# Altium schematic sheet Контроллер.SchDoc
size 594 x 420 mm; Address1: Address1; Address2: Address2; Address3: Address3; Address4: Address4; DocumentNumber: АБВГ.123456.001 Э3; SheetNumber: 1; Scale: 1:1; DocumentType: Схема электрическая принципиальная; FirstReferrence: АБВГ.123456.001
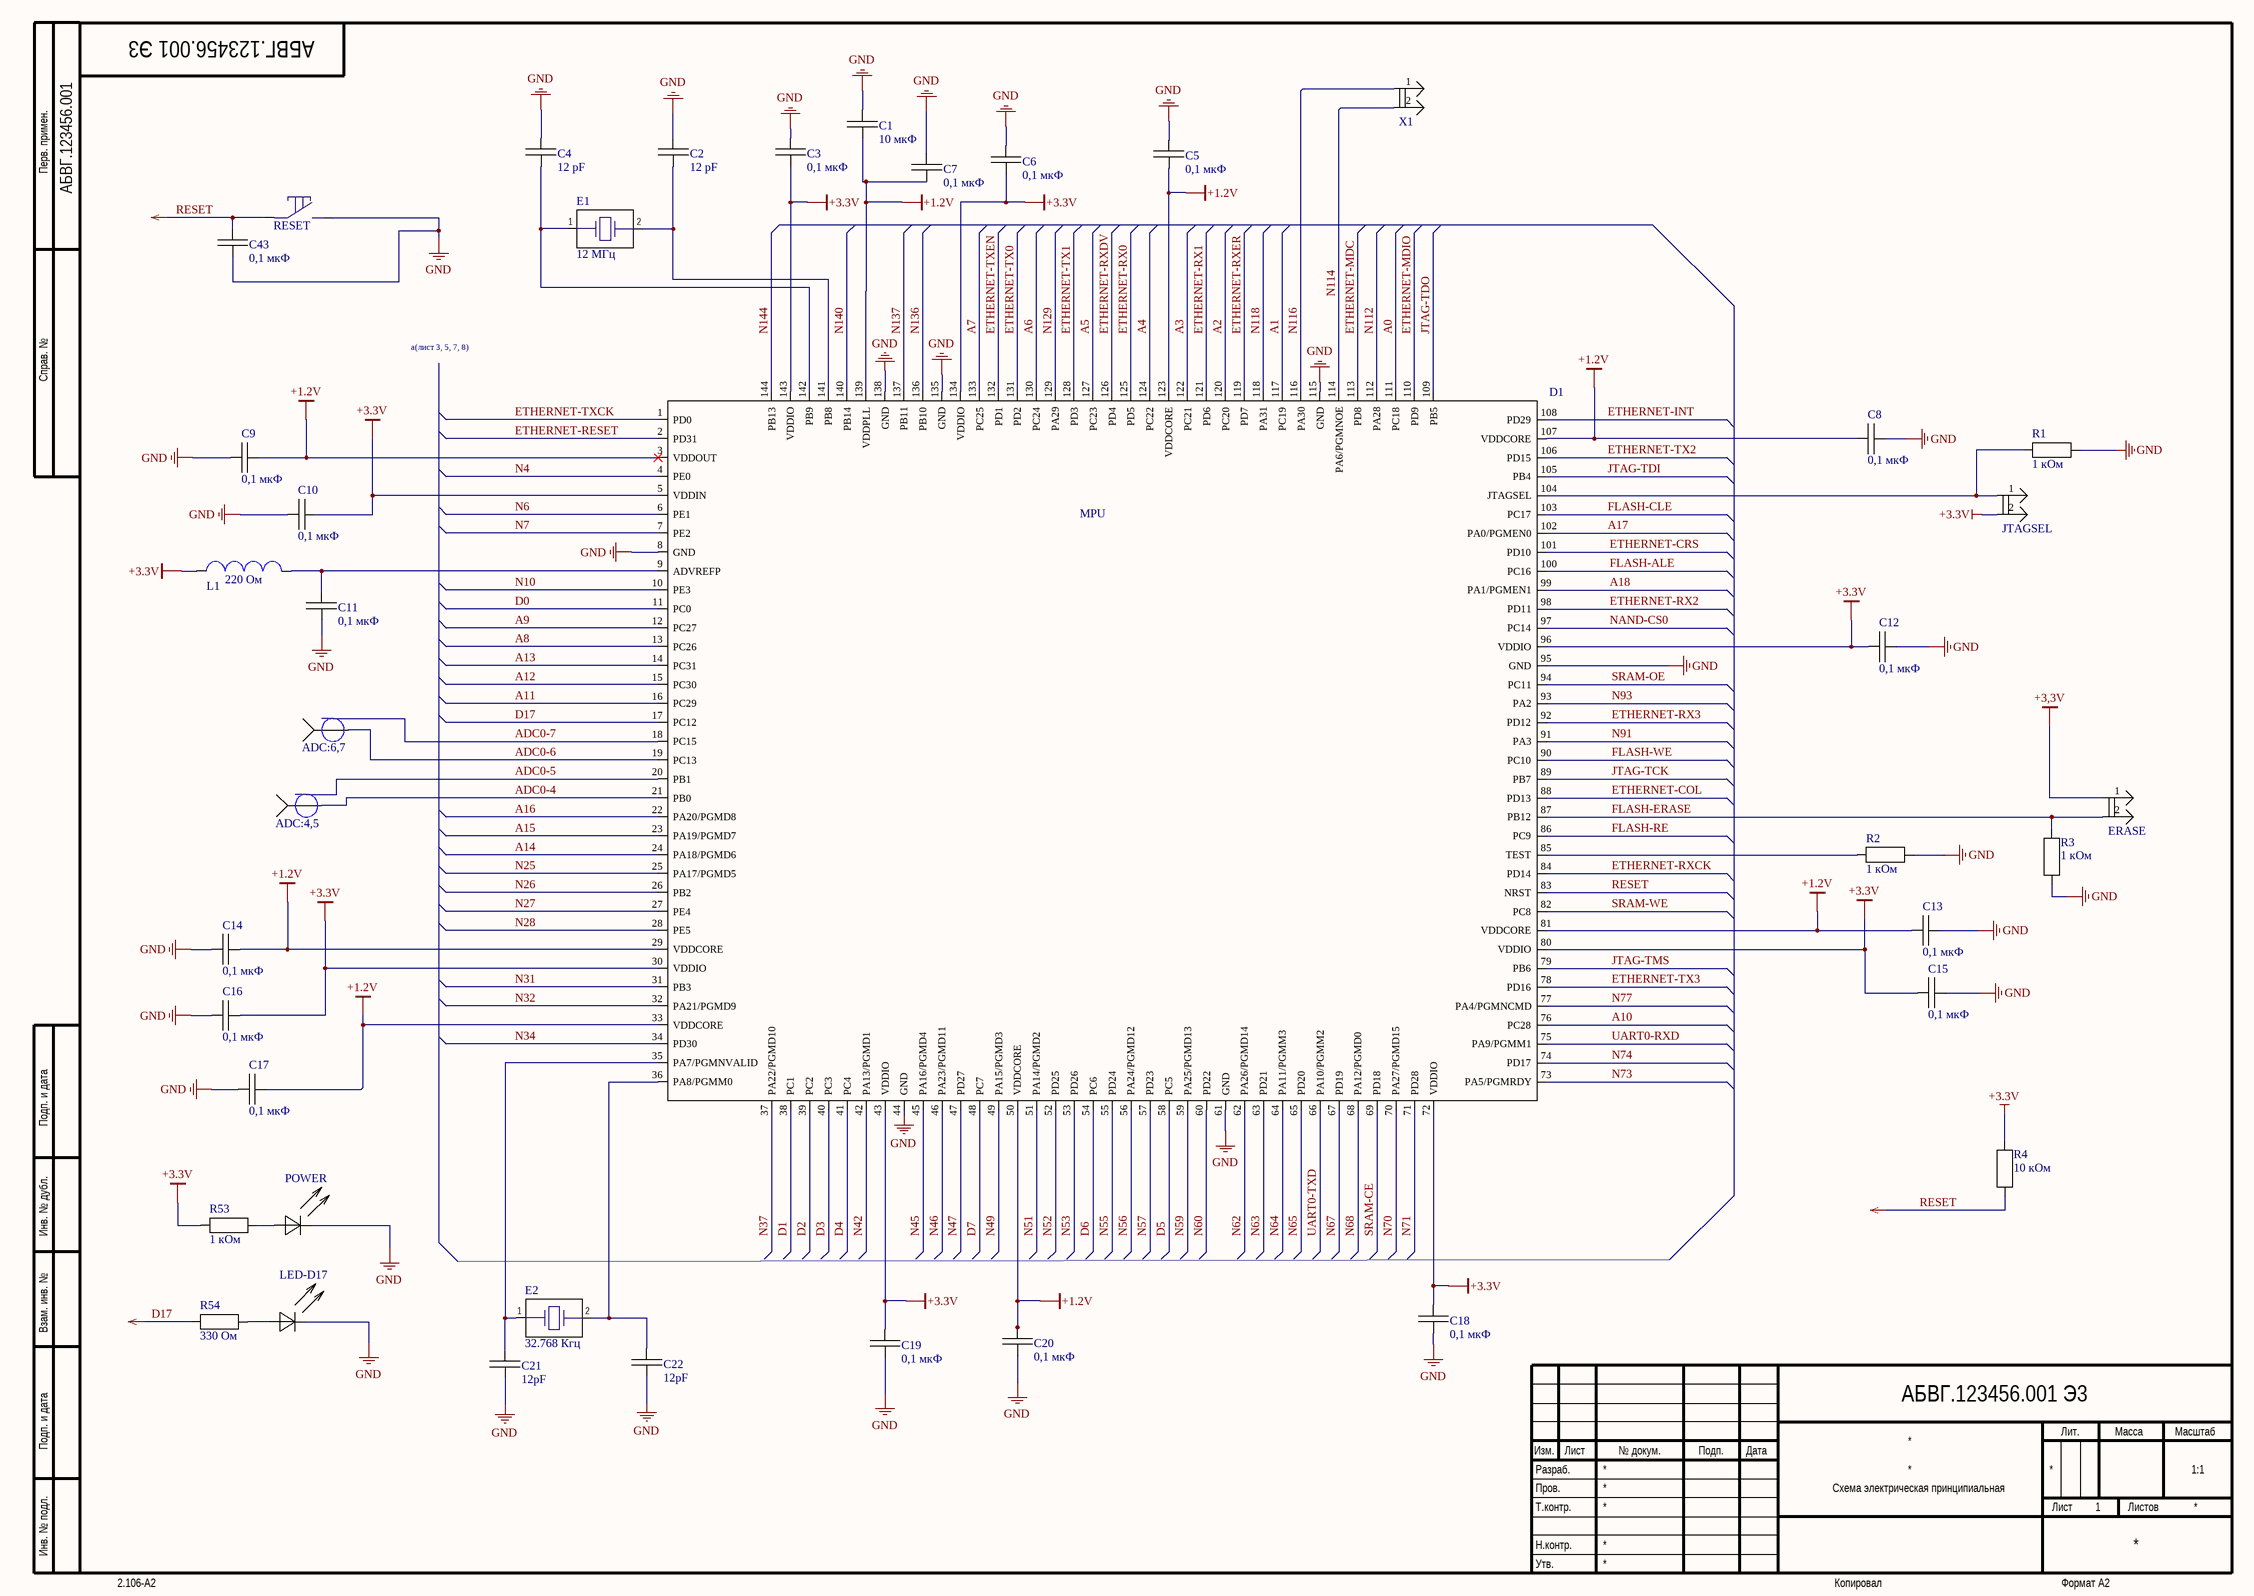
[diagram p0: Контроллер.SchDoc]

## Parts
ADC:4,5  (no value)  [SMA_Edge]
ADC:6,7  (no value)  [SMA_Edge]
C1  10 мкФ  [К10-2,0х1,25х1,0]
C2  12 pF  [0603-AVX]
C3  0,1 мкФ  [0603-AVX]
C4  12 pF  [0603-AVX]
C5  0,1 мкФ  [0603-AVX]
C6  0,1 мкФ  [0603-AVX]
C7  0,1 мкФ  [0603-AVX]
C8  0,1 мкФ  [0603-AVX]
C9  0,1 мкФ  [0603-AVX]
C10  0,1 мкФ  [0603-AVX]
C11  0,1 мкФ  [0603-AVX]
C12  0,1 мкФ  [0603-AVX]
C13  0,1 мкФ  [0603-AVX]
C14  0,1 мкФ  [0603-AVX]
C15  0,1 мкФ  [0603-AVX]
C16  0,1 мкФ  [0603-AVX]
C17  0,1 мкФ  [0603-AVX]
C18  0,1 мкФ  [0603-AVX]
C19  0,1 мкФ  [0603-AVX]
C20  0,1 мкФ  [0603-AVX]
C21  12pF  [0603-AVX]
C22  12pF  [0603-AVX]
C43  0,1 мкФ  [К10-1,6х0,8х0,7]
D1  (no value)  [LQFP-144]
E1  12 МГц  [HC49]
E2  32.768 Кгц  [HC49]
ERASE  (no value)  [СНП346-2ВП21-1]
JTAGSEL  (no value)  [СНП346-2ВП21-1]
L1  220 Ом  [BLM21P_0805]
LED-D17  (no value)  [PLCC4-1210]
POWER  (no value)  [PLCC4-1210]
R1  1 кОм  [Р1-8МП-0,125]
R2  1 кОм  [Р1-12-0,125]
R3  1 кОм  [Р1-12-0,125]
R4  10 кОм  [Р1-12-0,125]
R53  1 кОм  [Р1-12-0,125]
R54  330 Ом  [Р1-12-0,125]
RESET  (no value)  [Кнопка тактовая smd]
X1  (no value)  [СНП346-2ВП21-1]

## Nets
+1.2V: C1.2 C5.1 C7.1 C8.1 C9.2 C13.1 C14.2 C17.2 C20.2 D1.3(VDDOUT) D1.29(VDDCORE) D1.33(VDDCORE) D1.50(VDDCORE) D1.81(VDDCORE) D1.107(VDDCORE) D1.123(VDDCORE) D1.139(VDDPLL)
+3,3V: ERASE.1
+3.3V: C3.1 C6.1 C10.1 C12.1 C15.1 C16.2 C18.2 C19.2 D1.5(VDDIN) D1.30(VDDIO) D1.43(VDDIO) D1.72(VDDIO) D1.80(VDDIO) D1.96(VDDIO) D1.134(VDDIO) D1.143(VDDIO) JTAGSEL.2 L1.1 R4.2 R53.1
D17: C43.2 D1.17(PC12) D1.83(NRST) R4.1 R54.1 RESET.1  [also labelled RESET]
GND: ADC:4,5.2(GND) ADC:4,5.3(GND) ADC:4,5.4(GND) ADC:4,5.5(GND) ADC:6,7.2(GND) ADC:6,7.3(GND) ADC:6,7.4(GND) ADC:6,7.5(GND) C1.1 C2.2 C3.2 C4.2 C5.2 C6.2 C7.2 C8.2 C9.1 C10.2 C11.1 C12.2 C13.2 C14.1 C15.2 C16.1 C17.1 C18.1 C19.1 C20.1 C21.1 C22.1 C43.1 D1.8(GND) D1.44(GND) D1.61(GND) D1.95(GND) D1.115(GND) D1.135(GND) D1.138(GND) LED-D17.2 POWER.2 R1.2 R2.2 R3.2 RESET.2
A0: D1.111(PC18)
A1: D1.117(PC19)
A2: D1.120(PC20)
A3: D1.122(PC21)
A4: D1.124(PC22)
A5: D1.127(PC23)
A6: D1.130(PC24)
A7: D1.133(PC25)
A8: D1.13(PC26)
A9: D1.12(PC27)
A10: D1.76(PC28)
A11: D1.16(PC29)
A12: D1.15(PC30)
A13: D1.14(PC31)
A14: D1.24(PA18/PGMD6)
A15: D1.23(PA19/PGMD7)
A16: D1.22(PA20/PGMD8)
A17: D1.102(PA0/PGMEN0)
A18: D1.99(PA1/PGMEN1)
ADC0-4: ADC:4,5.1 D1.21(PB0)
ADC0-5: D1.20(PB1)
ADC0-6: ADC:6,7.1 D1.19(PC13)
ADC0-7: D1.18(PC15)
D0: D1.11(PC0)
D1: D1.38(PC1)
D2: D1.39(PC2)
D3: D1.40(PC3)
D4: D1.41(PC4)
D5: D1.58(PC5)
D6: D1.54(PC6)
D7: D1.48(PC7)
ETHERNET-COL: D1.88(PD13)
ETHERNET-CRS: D1.101(PD10)
ETHERNET-INT: D1.108(PD29)
ETHERNET-MDC: D1.113(PD8)
ETHERNET-MDIO: D1.110(PD9)
ETHERNET-RESET: D1.2(PD31)
ETHERNET-RX0: D1.125(PD5)
ETHERNET-RX1: D1.121(PD6)
ETHERNET-RX2: D1.98(PD11)
ETHERNET-RX3: D1.92(PD12)
ETHERNET-RXCK: D1.84(PD14)
ETHERNET-RXDV: D1.126(PD4)
ETHERNET-RXER: D1.119(PD7)
ETHERNET-TX0: D1.131(PD2)
ETHERNET-TX1: D1.128(PD3)
ETHERNET-TX2: D1.106(PD15)
ETHERNET-TX3: D1.78(PD16)
ETHERNET-TXCK: D1.1(PD0)
ETHERNET-TXEN: D1.132(PD1)
FLASH-ALE: D1.100(PC16)
FLASH-CLE: D1.103(PC17)
FLASH-ERASE: D1.87(PB12) ERASE.2 R3.1
FLASH-RE: D1.86(PC9)
FLASH-WE: D1.90(PC10)
JTAG-TCK: D1.89(PB7)
JTAG-TDI: D1.105(PB4)
JTAG-TDO: D1.109(PB5)
JTAG-TMS: D1.79(PB6)
N4: D1.4(PE0)
N6: D1.6(PE1)
N7: D1.7(PE2)
N10: D1.10(PE3)
N25: D1.25(PA17/PGMD5)
N26: D1.26(PB2)
N27: D1.27(PE4)
N28: D1.28(PE5)
N31: D1.31(PB3)
N32: D1.32(PA21/PGMD9)
N34: D1.34(PD30)
N37: D1.37(PA22/PGMD10)
N42: D1.42(PA13/PGMD1)
N45: D1.45(PA16/PGMD4)
N46: D1.46(PA23/PGMD11)
N47: D1.47(PD27)
N49: D1.49(PA15/PGMD3)
N51: D1.51(PA14/PGMD2)
N52: D1.52(PD25)
N53: D1.53(PD26)
N55: D1.55(PD24)
N56: D1.56(PA24/PGMD12)
N57: D1.57(PD23)
N59: D1.59(PA25/PGMD13)
N60: D1.60(PD22)
N62: D1.62(PA26/PGMD14)
N63: D1.63(PD21)
N64: D1.64(PA11/PGMM3)
N65: D1.65(PD20)
N67: D1.67(PD19)
N68: D1.68(PA12/PGMD0)
N70: D1.70(PA27/PGMD15)
N71: D1.71(PD28)
N73: D1.73(PA5/PGMRDY)
N74: D1.74(PD17)
N77: D1.77(PA4/PGMNCMD)
N91: D1.91(PA3)
N93: D1.93(PA2)
N112: D1.112(PA28)
N114: D1.114(PA6/PGMNOE) X1.2
N116: D1.116(PA30) X1.1
N118: D1.118(PA31)
N129: D1.129(PA29)
N136: D1.136(PB10)
N137: D1.137(PB11)
N140: D1.140(PB14)
N144: D1.144(PB13)
NAND-CS0: D1.97(PC14)
SRAM-CE: D1.69(PD18)
SRAM-OE: D1.94(PC11)
SRAM-WE: D1.82(PC8)
UART0-RXD: D1.75(PA9/PGMM1)
UART0-TXD: D1.66(PA10/PGMM2)
NetC2_1: C2.1 D1.141(PB8) E1.2
NetC4_1: C4.1 D1.142(PB9) E1.1
NetC11_2: C11.2 D1.9(ADVREFP) L1.2
NetC21_2: C21.2 D1.35(PA7/PGMNVALID) E2.1
NetC22_2: C22.2 D1.36(PA8/PGMM0) E2.2
NetD1_85: D1.85(TEST) R2.1
NetD1_104: D1.104(JTAGSEL) JTAGSEL.1 R1.1
NetLED-D17_1: LED-D17.1 R54.2
NetPOWER_1: POWER.1 R53.2

## Notes on the sheet
- а(лист 3, 5, 7, 8)
- Перв. примен.
- Справ. №
- Подп. и дата
- Инв. № дубл.
- Взам. инв. №
- Разраб.
- Изм.
- Лист
- № докум.
- Подп.
- Дата
- Лит.
- Масса
- Масштаб
- Пров.
- Т.контр.
- Листов
- Инв. № подл.
- Утв.
- Н.контр.
- 2.106-A2
- Копировал
- Формат А2
- (in symbol ATSAM4E16EA-ANR) MPU

## Library data of the parts
ADC:4,5 ADC:6,7 = SMA_EDGE: ManufacturerPartNumber: Розетка SMA (угловая, на плату); PartNumber: SMA(f); Category: Соединитель
C1 = 0805-X7R-10мкФ-10В-10%: Manufacturer: AVX; ManufacturerPartNumber: 0805ZC106KAT2A; TKE: X7R; Power/Voltage: 10 В; Tolerance: ±10%; Category: Конденсатор; Value: 10 мкФ; PartNumber: 0805ZC106KAT2A
C2 C4 C21 C22 = 0603-X7R-0,01мкФ-50В-10%: Manufacturer: AVX; ManufacturerPartNumber: 06035C103KAT4A; TKE: X7R; Power/Voltage: 50 В; Tolerance: ±10%; Category: Конденсатор; PartNumber: 06035C103KAT4A
  C2 C4: Value: 12 pF
  C21 C22: Value: 12pF
C3 C5-C20 = 0603-X7R-0,1мкФ-16В-10%: Manufacturer: AVX; ManufacturerPartNumber: 0603YC104KAT2A; TKE: X7R; Power/Voltage: 16 В; Tolerance: ±10%; Category: Конденсатор; Value: 0,1 мкФ; PartNumber: 0603YC104KAT2A
C43 = К10-79-10В-0,1мкФ Н90: PartNumber: АЖЯР.673511.004ТУ; ManufacturerPartNumber: К10-79-10 В-0,1 мкФ+80%-20% Н90; TKE: Н90; Power/Voltage: 10 В; Tolerance: +80%/-20%; VAR: 0,2; Category: Конденсатор; Value: 0,1 мкФ
D1 = ATSAM4E16EA-ANR: Manufacturer: Atmel; Category: Микросхема; ManufacturerPartNumber: ATSAM4E16EA-ANR
E1 = Crystal oscillator 16Mhz: Category: Генератор; ManufacturerPartNumber: Crystal oscillator 16Mhz; Value: 12 МГц
E2 = Crystal oscillator 32.768Khz: Category: Генератор; ManufacturerPartNumber: Crystal oscillator 32.768 Khz; Value: 32.768 Кгц
ERASE JTAGSEL X1 = СНП346-2ВП21-1: ManufacturerPartNumber: Вилка СНП346-2ВП21-1; PartNumber: РЮМК.430420.011ТУ; Category: Соединитель
L1 = BLM21PG221SH1: Manufacturer: Murata; PartNumber1: (220 Ом ±25% 2000мА); Power/Voltage: 2000мА; Tolerance: ±25%; Category: Катушка индуктивности; ManufacturerPartNumber: BLM21PG221SH1; Value: 220 Ом
LED-D17 POWER = 1210 LED: PartNumber: LED, 1210; Category: Диод; ManufacturerPartNumber: 1210 LED
R1 = Р1-8МП-0,125-5,1 кОм±1%: PartNumber: ОЖ0.467.164ТУ; ManufacturerPartNumber: Р1-8МП-0,125-5,1 кОм±1%-0,5-Л; Value: 5,1кОм; Tolerance: ±1%-0,5-Л; Power/Voltage: 0,125; Category: Резистор
R2 R4 = Р1-12-0,125-10,0 кОм±1%: PartNumber: АЛЯР.434110.005 ТУ; ManufacturerPartNumber: Р1-12-0,125-10,0 кОм±1%-Л; Tolerance: ±1%-Л; Power/Voltage: 0,125; Category: Резистор
  R2: Value: 1 кОм
  R4: Value: 10 кОм
R3 = Р1-12-0,125-10,0 кОм±1%: PartNumber: АЛЯР.434110.005 ТУ; ManufacturerPartNumber: Р1-12-0,125-10,0 кОм±1%-Л; Value: 2 кОм; Tolerance: ±1%-Л; Power/Voltage: 0,125; Category: Резистор
R53 R54 = Р1-12-0,125-200 Ом±5%: PartNumber: АЛЯР.434110.005 ТУ; ManufacturerPartNumber: Р1-12-0,125-200 Ом±5%-Л; Tolerance: ±5%-Л; Power/Voltage: 0,125; Category: Резистор
  R53: Value: 1 кОм
  R54: Value: 330 Ом
RESET = Кнопка тактовая smd: Category: Соединитель